# EAGLE design myGlasses (EAGLE 6.6.0)
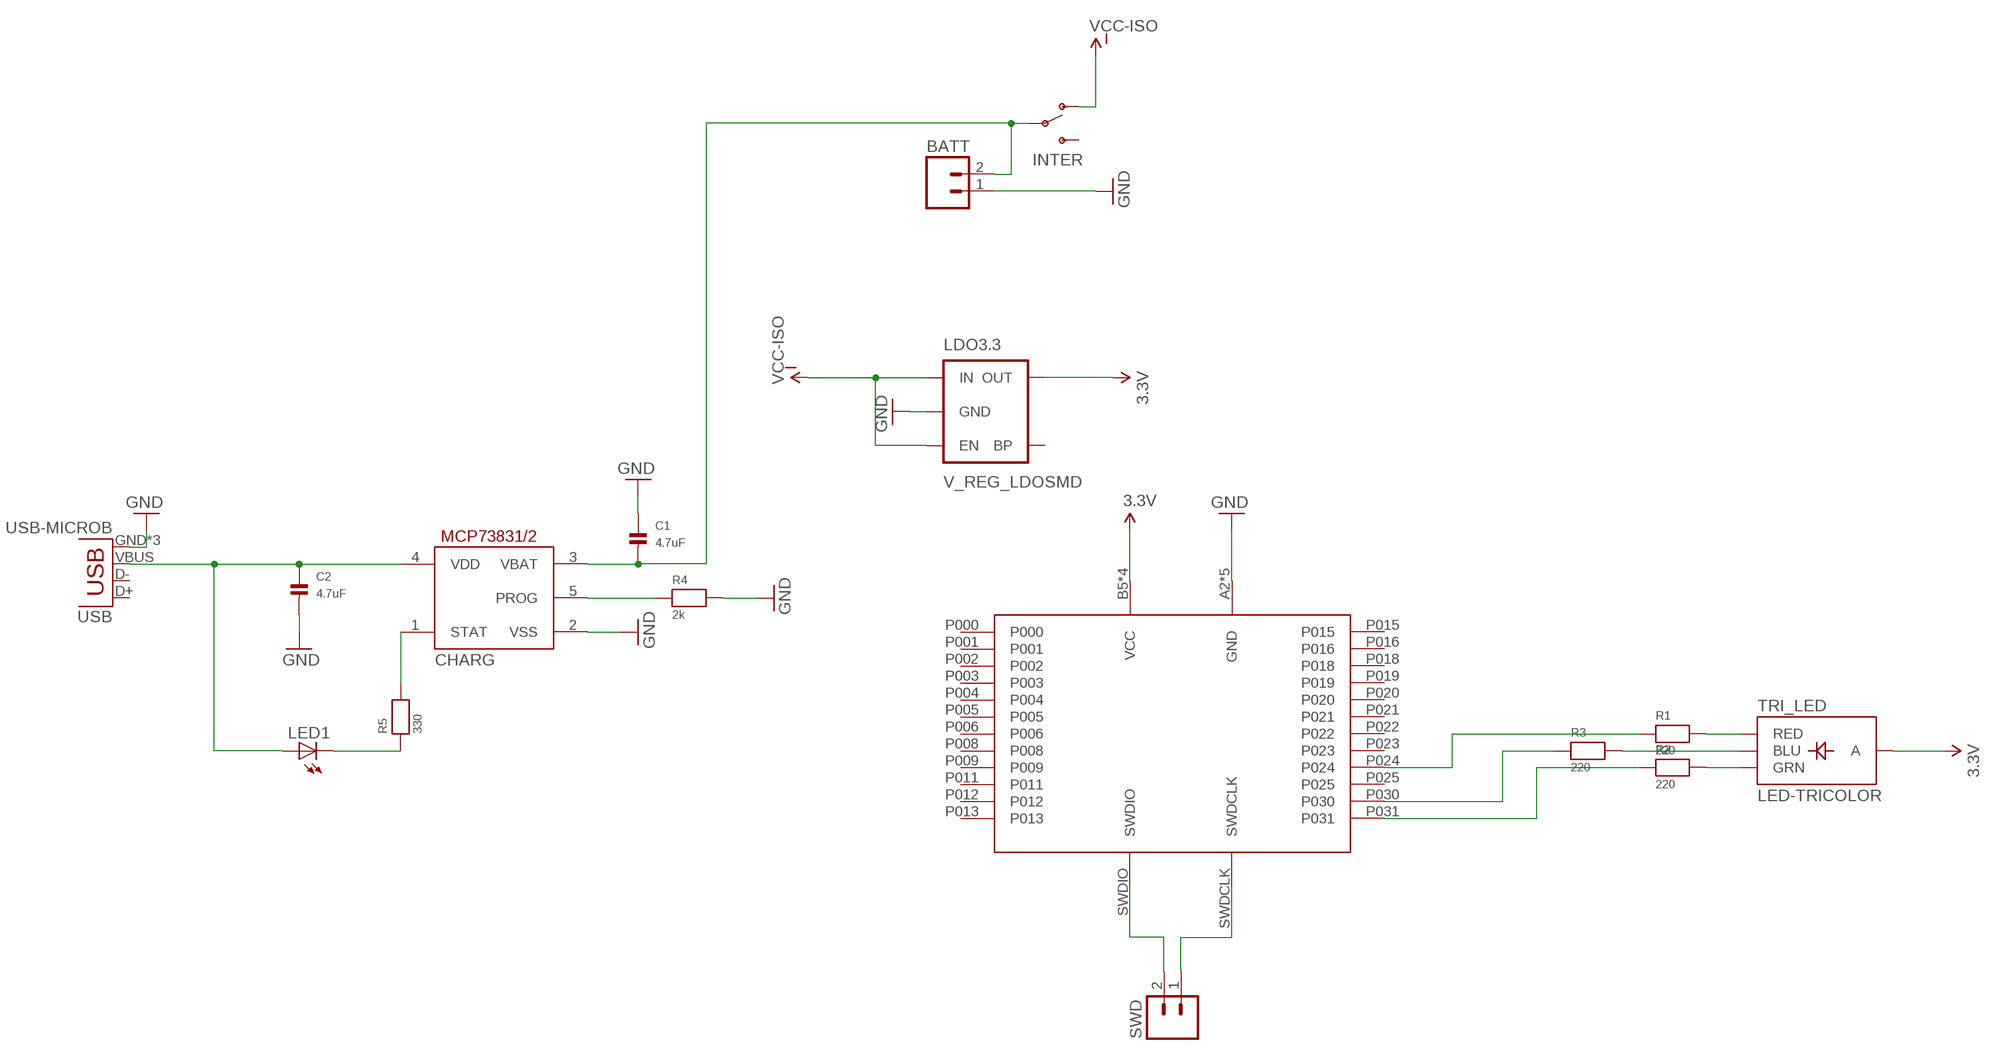
[diagram p0: schematic, sheet 1]

## Parts
BATT  M02PTH3  [1X02_LONGPADS]
C1  4.7uF  CAP_CERAMIC1206  [1206]
C2  4.7uF  CAP_CERAMIC1206  [1206]
CHARG  MCP73831/OT  [SOT23-5L]
INTER  SWITCH-SPDTPTH_LOCK  [SWITCH-SPDT_LOCK.007S]
LDO3.3  V_REG_LDOSMD  [SOT23-5]
LED1  LEDCHIPLED_1206  [CHIPLED_1206]
N550  N548  [N548]
R1  220  RESISTOR1206  [1206]
R2  220  RESISTOR1206  [1206]
R3  220  RESISTOR1206  [1206]
R4  2k  RESISTOR1206  [1206]
R5  330  RESISTOR1206  [1206]
SWD  M02PTH  [1X02]
TRI_LED  LED-TRICOLOR  [LED-TRICOLOR-SMD]
USB  USB-MICROB  [USB-MICROB]

## Nets
3.3V: LDO3.3.5(OUT) N550.B5(VCC) N550.B6(VCC) N550.C5(VCC) N550.C6(VCC) TRI_LED.A
GND [pwr]: BATT.1 C1.1 C2.2 CHARG.2(VSS) LDO3.3.2(GND) N550.A2(GND) N550.A3(GND) N550.A4(GND) N550.A5(GND) N550.A6(GND) R4.2 USB.GND USB.MT1(GND) USB.MT2(GND)
N$1 [pwr]: BATT.2 C1.2 CHARG.3(VBAT) INTER.2(P)
N$2: R1.2 TRI_LED.R(RED)
N$3: R2.2 TRI_LED.G(GRN)
N$4: R3.2 TRI_LED.B(BLU)
N$5: C2.1 CHARG.4(VDD) LED1.A USB.VBUS
N$6: N550.SWDIO SWD.2
N$7: CHARG.5(PROG) R4.1
N$8: CHARG.1(STAT) R5.2
N$9: LED1.C R5.1
N$10: N550.SWDCLK SWD.1
N$11: N550.P024 R1.1
N$12: N550.P030 R3.1
N$13: N550.P031 R2.1
VCC-ISO: INTER.1(O) LDO3.3.1(IN) LDO3.3.3(EN)
Unconnected: INTER.3(S) LDO3.3.4(BP) N550.P000 N550.P001 N550.P002 N550.P003 N550.P004 N550.P005 N550.P006 N550.P008 N550.P009 N550.P011 N550.P012 N550.P013 N550.P015 N550.P016 N550.P018 N550.P019 N550.P020 N550.P021 N550.P022 N550.P023 N550.P025 USB.D+ USB.D-

## Library data of the parts
BATT SWD = SparkFun-Connectors:M02: Standard 2-pin 0.1" header. Use with - straight break away headers ( PRT-00116) - right angle break away headers (PRT-00553) - swiss pins (PRT-00743) - machine pins (PRT-00117) - female headers (PRT-00115) Molex polarized connector foot print use with: PRT-08233 with associated crimp pins and housings. 2.54_SCREWTERM for use with PRT-10571. 3.5mm Screw Terminal footprints for PRT-08084 5mm Screw Terminal footprints for use with PRT-08432
C1 C2 = microbuilder:CAP_CERAMIC: Ceramic Capacitors 0402 - 0402 Surface Mount Capacitors 16pF 50V 5% [Digikey: 445-4899-2-ND] 18pF 50V 5% [Digikey: 490-1281-2-ND] 22pF 50V 5% [Digikey: 490-1283-2-ND] 68pF 50V 5% [Digikey: 490-1289-2-ND] 0.1uF 10V 10% [Digikey: 490-1318-2-ND] 1.0uF 6.3V 10% [Digikey: 490-1320-2-ND] 0603 - 0603 Surface Mount Capacitors 16 pF 50V 5% [Digikey: 445-5051-2-ND] 22 pF 50V [Digikey: PCC220ACVTR-ND] 33 pF 50V 5% [Digikey: 490-1415-1-ND] 56pF 50V 5% [Digikey: 490-1421-1-ND] 220pF 50V 5% [Digikey: 445-1285-1-ND] 680 pF 50V 2200 pF 50V 5% C0G [Digikey: 445-1297-1-ND] 5600 pF 100V 5% X7R [Digikey: 478-3711-1-ND] 0.1 µF 25V 10% [Digikey: PCC2277TR-ND] 0.22 µF 16V 10% X7R [Digikey: 445-1318-1-ND] 1.0 µF 25V 10% [Digikey: 445-5146-2-ND] 0603 - RF Specific 3pF 250V +/-0.1pF RF [Digikey: 712-1347-1-ND] 18 pF 250V 5% [Digikey: 478-3505-1-ND or 712-1322-1-ND] 56 pF 250V 5% C0G RF [Digikey: 490-4867-1-ND] 68 pF 250V RF [Digikey: 490-4868-1-ND] 0805 - 0805 Surface Mount Capacitors 220 pF 250V 2% RF Ceramic Capacitor [Digikey: 712-1398-1-ND] 1000 pF 50V 2% NP0 Ceramic Capacitor [Digikey: 478-3760-1-ND] 0.1 µF 25V 10% Ceramic Capacitor [Digikey: PCC1828TR-ND] 1.0 µF 16V 10% Ceramic Capacitor[Digikey: 490-1691-2-ND] 10.0 µF 10V 10% Ceramic Capacitor[Digikey: 709-1228-1-ND] 10.0 uF 16V 10% Ceramic Capacitor [Digikey: 478-5165-2-ND] 47 uF 6.3V 20% Ceramic Capacitor [Digikey: 587-1779-1-ND or 399-5506-1-ND] 1206 - 1206 Surface Mount Capacitors 47uF 10V 20% Ceramic Capacitor [Digikey: 490-5528-1-ND or 399-5508-1-ND or 445-6010-1-ND] 100uF 6.3V -20%, +80% Y5V Ceramic Capacitor (Digikey: 490-4512-1-ND, Mouser: 81-GRM31CF50J107ZE1L)
CHARG = adafruit:MCP73831: MCP73831/2 Miniature Single-Cell, Fully Integrated Li-Ion, Li-Polymer Charge Management Controllers. Nice and small simple lipoly charge controller, with adjustable current and status output (LED) http://www.ladyada.net/library/pcb/eaglelibrary.html
INTER = SparkFun-Electromechanical:SWITCH-SPDT: SPDT Switch Simple slide switch, Spark Fun Electronics SKU : COM-00102 DPDT SMT slide switch, AYZ0202, SWCH-08179
LDO3.3 = SparkFun-PowerIC:V_REG_LDO: Voltage Regulator LDO Standard 150mA LDO voltage regulator in SOT-23 layout. Micrel part MIC5205. BP (by-pass) pin is used to lower output noise with 470pF cap.
LED1 = adafruit:LED: LED OSRAM: - CHIPLED LG R971, LG N971, LY N971, LG Q971, LY Q971, LO R971, LY R971 LH N974, LH R974 LS Q976, LO Q976, LY Q976 LO Q996 - Hyper CHIPLED LW Q18S LB Q993, LB Q99A, LB R99A - SideLED LS A670, LO A670, LY A670, LG A670, LP A670 LB A673, LV A673, LT A673, LW A673 LH A674 LY A675 LS A676, LA A676, LO A676, LY A676, LW A676 LS A679, LY A679, LG A679 - Hyper Micro SIDELED® LS Y876, LA Y876, LO Y876, LY Y876 LT Y87S - SmartLED LW L88C, LW L88S LB L89C, LB L89S, LG L890 LS L89K, LO L89K, LY L89K LS L896, LA L896, LO L896, LY L896 - TOPLED LS T670, LO T670, LY T670, LG T670, LP T670 LSG T670, LSP T670, LSY T670, LOP T670, LYG T670 LG T671, LOG T671, LSG T671 LB T673, LV T673, LT T673, LW T673 LH T674 LS T676, LA T676, LO T676, LY T676, LB T676, LH T676, LSB T676, LW T676 LB T67C, LV T67C, LT T67C, LS T67K, LO T67K, LY T67K, LW E67C LS E67B, LA E67B, LO E67B, LY E67B, LB E67C, LV E67C, LT E67C LW T67C LS T679, LY T679, LG T679 LS T770, LO T770, LY T770, LG T770, LP T770 LB T773, LV T773, LT T773, LW T773 LH T774 LS E675, LA E675, LY E675, LS T675 LS T776, LA T776, LO T776, LY T776, LB T776 LHGB T686 LT T68C, LB T68C - Hyper Mini TOPLED® LB M676 - Mini TOPLED Santana® LG M470 LS M47K, LO M47K, LY M47K Source: http://www.osram.convergy.de/
N550 = N548:N548: Based on Nordic Semiconductor’s nRF51422 SoC, the N5 ANT SoC module series offers support for both ANT® and Bluetooth® low energy and enables both protocols to run concurrently, depending on the loaded protocol stack. The N5 ANT SoC module series starts with N548M8CB in a 14.0mm x 9.8mm x 2.0mm LGA (Land Array Grid) package. A compact design meeting the market requirements for small, light and wearable, the N548M8CB is a turnkey system hardware solution including antenna, onboard 32k and 16M crystal clocks, DC-DC converter and 24 GPIOs with 6 analogue inputs. The N548 modules are pre-programmed with the following software components:  S210 SoftDevice (ANT 8-channel protocol stack)  ANT network processor application  ANT-WP (Wireless Programming) bootloader (depends on module version) SoftDevices are protocol stack solutions from Nordic Semiconductor for the nRF51 SoCs. There are multiple SoftDevice choices available from the Nordic Semiconductor’s web site. The ANT network processor application offers the standard ANT serial interface front-end that is connectable to an external application controller. The ANT-WP bootloader allows over-the-air updates of any software components on the N548 module. The N548 module pre-programmed image can be easily replaced via the onboard SWD interface pins using offthe- shelf ARM programming tools or over the air using the pre-loaded ANT-WP bootloader. Pin compatible options to the 20mm x 20mm AP2 or C7 modules from Dynastream are also available. In these options, N548M8CB modules are soldered on carrier boards that are pin compatible to the previous modules. Current AP2 or C7 module customers can easily use these models to evaluate the hardware and upgrade their products. The N5 module series if loaded with ANT and/or BLUETOOTH Low energy stack has been certified to comply with radio regulation or standards covering major markets include North America, Europe, Australia, New Zealand and Japan. The N5 ANT SoC modules series has also been qualified by the BLUETOOTH SIG.
R1-R5 = microbuilder:RESISTOR: Resistors 0402 - 0402 Surface Mount Package 22 Ohm 1% 1/16W [Digikey: 311-22.0LRTR-ND] 33 Ohm 5% 1/16W 1.0K 5% 1/16W 1.5K 5% 1/16W 2.0K 1% 1/16W 10.0K 1% 1/16W [Digikey: 311-10.0KLRTR-ND] 10.0K 5% 1/16W [Digikey: RMCF0402JT10K0TR-ND] 12.1K 1% 1/16W [Digikey: 311-22.0LRTR-ND] 100.0K 5% 1/16W 0603 - 0603 Surface Mount Package 0 Ohm 1/10 Watt 1% Resistor 15 Ohm 1/10 Watt 1% Resistor 33 Ohm 1/10 Watt 1% Resistor 49.9 Ohm 1/10 Watt 1% Resistor 100 Ohm 1/10 Watt 1% Resistor 150 Ohm 1/10 Watt 1% Resistor 240 Ohm 1/10 Watt 1% Resistor 390 Ohm 1/10 Watt 1% Resistor 560 Ohm 1/10 Watt 1% Resistor 680 Ohm 1/10 Watt 1% Resistor 750 Ohm 1/10 Watt 1% Resistor 1.0K Ohm 1/10 Watt 1% Resistor 1.5K Ohm 1/10 Watt 1% Resistor 2.0K Ohm 1/10 Watt 1% Resistor 2.2K Ohm 1/10 Watt 1% Resistor 3.3K Ohm 1/10 Watt 1% Resistor 4.7K Ohm 1/10 Watt 1% Resistor 10.0K Ohm 1/10 Watt 1% Resistor 12.0K Ohm 1/10 Watt 1% Resistor 12.1K Ohm 1/10 Watt 1% Resistor 20.0K Ohm 1/10 Watt 1% Resistor 33.0K Ohm 1/10 Watt 1% Resistor 100.0K Ohm 1/10 Watt 1% Resistor 0805 - 0805 Surface Mount Package 0 Ohm 1/8 Watt 1% Resistor 33 Ohm 1/8 Watt 1% Resistor 100 Ohm 1/8 Watt 1% Resistor 150 Ohm 1/8 Watt 1% Resistor 200 Ohm 1/8 Watt 1% Resistor 240 Ohm 1/8 Watt 1% Resistor 330 Ohm 1/8 Watt 1% Resistor 390 Ohm 1/8 Watt 1% Resistor 470 Ohm 1/8 Watt 1% Resistor 1.0K Ohm 1/8 Watt 1% Resistor 1.5K Ohm 1/8 Watt 1% Resistor 2.0K Ohm 1/8 Watt 1% Resistor 4.7K Ohm 1/8 Watt 1% Resistor 5.1K Ohm 1/8 Watt 1% Resistor 5.6K Ohm 1/8 Watt 1% Resistor 10.0K Ohm 1/8 Watt 1% Resistor 22.0K Ohm 1/8 Watt 1% Resistor 33.0K Ohm 1/8 Watt 1% Resistor 100K Ohm 1/8 Watt 1% Resistor 1206 - 1206 Surface Mount Package 2012 - 2010 Surface Mount Package 0.11 Ohm 1/2 Watt 1% Resistor - Digikey: RHM.11UCT-ND
TRI_LED = SparkFun-LED:LED-TRICOLOR: Tri-Color LED SMD Proven layout and schematic for triple color LED in SMD package - common anode. Spark Fun Electronics SKU : COM-07844
USB = SparkFun-Connectors:USB: USB Connectors USB-B-PTH is fully proven SKU : PRT-00139/CONN-08278 USB-miniB is fully proven SKU : PRT-00587 USB-A-PCB is untested. USB-A-H is throughly reviewed, but untested. Spark Fun Electronics SKU : PRT-00437 USB-B-SMT is throughly reviewed, but untested. Needs silkscreen touching up. USB-A-S has not been used/tested USB-MB-H has not been used/tested USB-MICROB has been used. CONN-09505; PROD_ID: CONN-09505

## Net classes
0 default: width 0.178 mm, drill 0.152 mm, clearance 0.152 mm
1 pwr: width 0.33 mm, drill 0.178 mm, clearance 0.178 mm

## Board
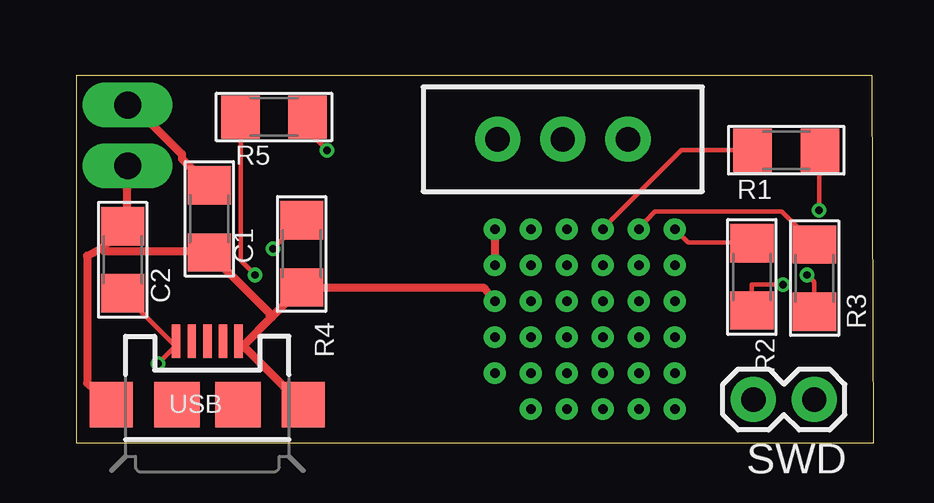
[diagram p1: board, top side]
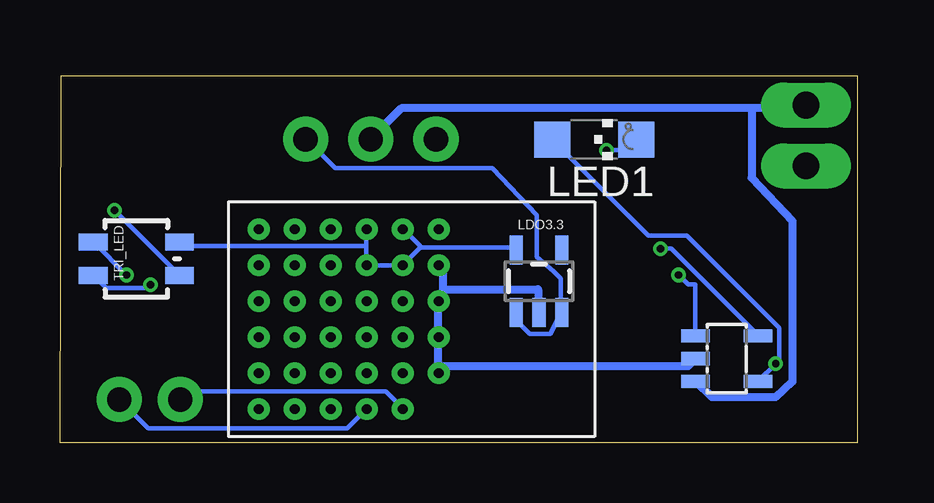
[diagram p2: board, bottom side, seen from below]

Size 33.22 x 15.31 mm. Coordinates in mm from the lower left corner, seen from the top.
Outline: 0,0 33.22,0 33.17,15.31 0,15.31 0,0
Copper layers (1*16): Top 0.035mm / dielectric 1.5mm / Bottom 0.035mm
Design rules "SeeedStudio_2layer_DRU_no_angle_20140221": minimum track width 6mil, minimum drill 12mil, track to track 6mil, track to pad 6mil, pad to pad 6mil, via to via 6mil, smd to smd 0mil, copper to edge 10mil, drill to drill 10mil, minimum pad ring 10mil, minimum via ring 6mil, stop-mask expansion 2mil, vias tented up to drill 100mil, thermal gap 10mil

### Footprints (pad centres in the part's own frame; a part is rotated, then mirrored left to right if it is on the bottom)
1X02_LONGPADS = drill 1.118 pad 1.88 long: 1 0,0; 2 2.54,0
1206 = smd 1.6 x 1.8: 1 -1.4,0; 2 1.4,0
SOT23-5L = smd 0.55 x 1.2: 1 -0.95,-1.3; 2 0,-1.3; 3 0.95,-1.3; 4 0.95,1.3; 5 -0.95,1.3
SWITCH-SPDT_LOCK.007S = drill 1.016 pad 1.88: 1 0,2.718; 2 0,0; 3 0,-2.718
SOT23-5 = smd 0.55 x 1.2: 1 -0.95,-1.3; 2 0,-1.3; 3 0.95,-1.3; 4 0.95,1.3; 5 -0.95,1.3
CHIPLED_1206 = smd 1.5 x 1.5: A 0,-1.75; C 0,1.75
N548 = drill 0.4 pad 0.72: A2 6,7.5; A3 4.5,7.5; A4 3,7.5; A5 1.5,7.5; A6 0,7.5; B5 1.5,6; B6 0,6; C5 1.5,4.5; C6 0,4.5; P000 1.5,1.5; P001 3,0; P002 1.5,0; P003 4.5,0; P004 3,1.5; P005 6,0; P006 4.5,1.5; P008 7.5,0; P009 7.5,1.5; P011 6,1.5; P012 7.5,3; P013 6,4.5; P015 6,3; P016 4.5,4.5; P018 6,6; P019 3,6; P020 4.5,6; P021 1.5,3; P022 3,4.5; P023 3,3; P024 0,3; P025 4.5,3; P030 0,1.5; P031 0,0; SWDCLK 7.5,4.5; SWDIO 7.5,6
1X02 = drill 1.016 pad 1.88: 1 0,0; 2 2.54,0
LED-TRICOLOR-SMD = smd 0.7 x 1.2: A 0.7,-1.8; B 0.7,1.8; G -0.7,1.8; R -0.7,-1.8
USB-MICROB = smd 0.35 x 1.4: D+ 0,2.65; D- -0.65,2.65; GND 1.3,2.65; ID 0.65,2.65; VBUS -1.3,2.65 | smd 1.8 x 1.9: MT1 -4,0; MT2 4,0 | smd 1.9 x 1.9: P$1 -1.27,0; P$2 1.27,0

### Placement (x,y rotation side)
BATT  2.14,11.55 90 top
C1  5.54,9.34 90 top
C2  1.93,7.64 90 top
CHARG  5.44,3.51 270 bottom
INTER  20.27,12.66 270 top
LDO3.3  13.26,6.74 0 bottom
LED1  10.97,12.65 270 bottom
N550  24.94,8.91 270 bottom
R1  29.58,12.2 0 top
R2  28.15,6.92 270 top
R3  30.76,6.87 270 top
R4  9.39,7.88 270 top
R5  8.24,13.59 180 top
SWD  30.75,1.81 180 top
TRI_LED  30.04,7.68 90 bottom
USB  5.46,1.59 0 top

### Tracks (layer width: path | path; a pad name or v marks a point on that pad's centre or on a via)
3.3V
  Bottom 0.178: 18.2,8.15 14.35,8.15 14.25,8.05 LDO3.3.5 | 18.2,8.15 N550.B5 19,7.4 20.4,7.4 N550.C5 20.45,7.5 20.45,8.2 | N550.B6 18.9,8.9 18.2,8.2 18.2,8.15 | 20.45,8.2 N550.C6 | 20.45,8.2 28.05,8.2 28.2,8.35 TRI_LED.A
GND
  Top 0.33: 6.95,4.05 9.45,1.55 USB.MT2 | 6.95,4.05 USB.GND | 6.95,4.05 8.15,5.25 | 8.15,5.25 9.35,6.45 R4.2 9.55,6.45 17,6.45 17.4,5.95 N550.A4 | 8.15,5.25 8.05,5.35 8.05,5.4 5.55,7.9 C1.1 5.4,8 1.15,8 1.05,8.1 | BATT.1 2.1,11.55 2.1,9.2 1.95,9.05 C2.2 1.85,8.9 1.05,8.1 | USB.MT1 0.45,2.5 0.45,7.8 1.05,8.1 | N550.A6 17.45,7.45 N550.A5
  Bottom 0.33: 17.25,6.4 13.3,6.4 13.3,5.45 LDO3.3.2 | 17.25,6.4 N550.A4 17.45,5.7 17.45,4.5 N550.A3 17.45,3.2 17.15,3.2 | 17.25,6.4 17.25,7.4 N550.A5 | CHARG.2 7.05,3.2 17.15,3.2 | N550.A2 17.15,3.2
N$1
  Top 0.33: C1.2 5.5,10.75 4.4,11.85 4.4,12.05 2.4,14.05 2.15,14.05 BATT.2
  Bottom 0.33: 4.4,13.95 4.4,11.05 2.7,9.25 2.7,2.55 3.4,1.9 6.05,1.9 6.7,2.55 CHARG.3 | 4.4,13.95 2.15,13.95 BATT.2 | 4.4,13.95 19,13.95 20.25,12.7 INTER.2
N$2  (via drill 0.3)
  Top 0.178: v30.95,9.7 30.95,12.2 R1.2
  Bottom 0.178: v30.95,9.7 28.25,7 TRI_LED.R
N$3  (via drill 0.3)
  Top 0.178: v29.45,6.6 28.15,6.6 R2.2
  Bottom 0.178: v29.45,6.6 29.6,6.45 31.3,6.45 31.8,6.95 TRI_LED.G
N$4  (via drill 0.3)
  Top 0.178: v30.45,7 30.75,6.7 30.75,5.5 R3.2
  Bottom 0.178: v30.45,7 31.8,8.35 TRI_LED.B
N$5  (via drill 0.3)
  Top 0.178: v3.4,3.3 4.15,4.05 4.15,4.2 USB.VBUS 4.05,4.05 4.05,4.1 1.95,6.2 C2.1
  Bottom 0.178: CHARG.4 v3.4,3.3 3.35,3.35 3.25,3.35 3.25,4.8 7.1,8.65 8.7,8.65 12.7,12.65 LED1.A
N$6
  Bottom 0.178: N550.SWDIO 18.95,1.45 19.65,2.15 27.9,2.15 28.2,1.85 SWD.2
N$7  (via drill 0.3)
  Top 0.178: v8.2,8.1 9.35,9.25 R4.1
  Bottom 0.178: v8.2,8.1 7.75,8.1 4.15,4.5 CHARG.5
N$8  (via drill 0.3)
  Top 0.178: v7.45,7 6.85,7.6 6.85,13.55 R5.2
  Bottom 0.178: v7.45,7 7.05,6.6 6.75,6.6 6.75,4.5 CHARG.1
N$9  (via drill 0.3)
  Top 0.178: v10.45,12.2 9.65,13 9.65,13.55 R5.1
  Bottom 0.178: v10.45,12.2 9.7,12.2 9.25,12.65 LED1.C
N$10
  Bottom 0.178: N550.SWDCLK 21.25,0.6 29.55,0.6 SWD.1
N$11
  Top 0.178: R1.1 25.2,12.2 21.95,8.95 N550.P024
N$12
  Top 0.178: R3.1 30.75,8.3 29.4,9.65 24.1,9.65 23.45,8.95 N550.P030
N$13
  Top 0.178: N550.P031 25.5,8.35 28.15,8.35 R2.1
VCC-ISO
  Bottom 0.178: LDO3.3.1 14.2,5.4 14.2,5.1 13.65,4.55 12.8,4.55 12.35,5.4 LDO3.3.3 12.35,5.5 12.35,6.85 12.65,7.15 13.35,7.75 13.35,9.5 15.2,11.45 21.75,11.45 22.95,12.65 INTER.1